# EasyEDA Pro project ProProject_Access Control USB Hub Switch_2024-05-28.epro

# Schematic V2.0.1 Schematic
Create Date: 2024-05-01; Page Name: Main Page; Project Name: Access Control V2.1; Schematic Name: V2.0.1 USB Schematic; Update Date: 2024-05-22; Company: RIT SHED MAKERSPACE; Drawn: Jim Heaney; Page Size: A4; Part Number: N/A; Reviewed: Jim Heaney; Version: V2.1.0
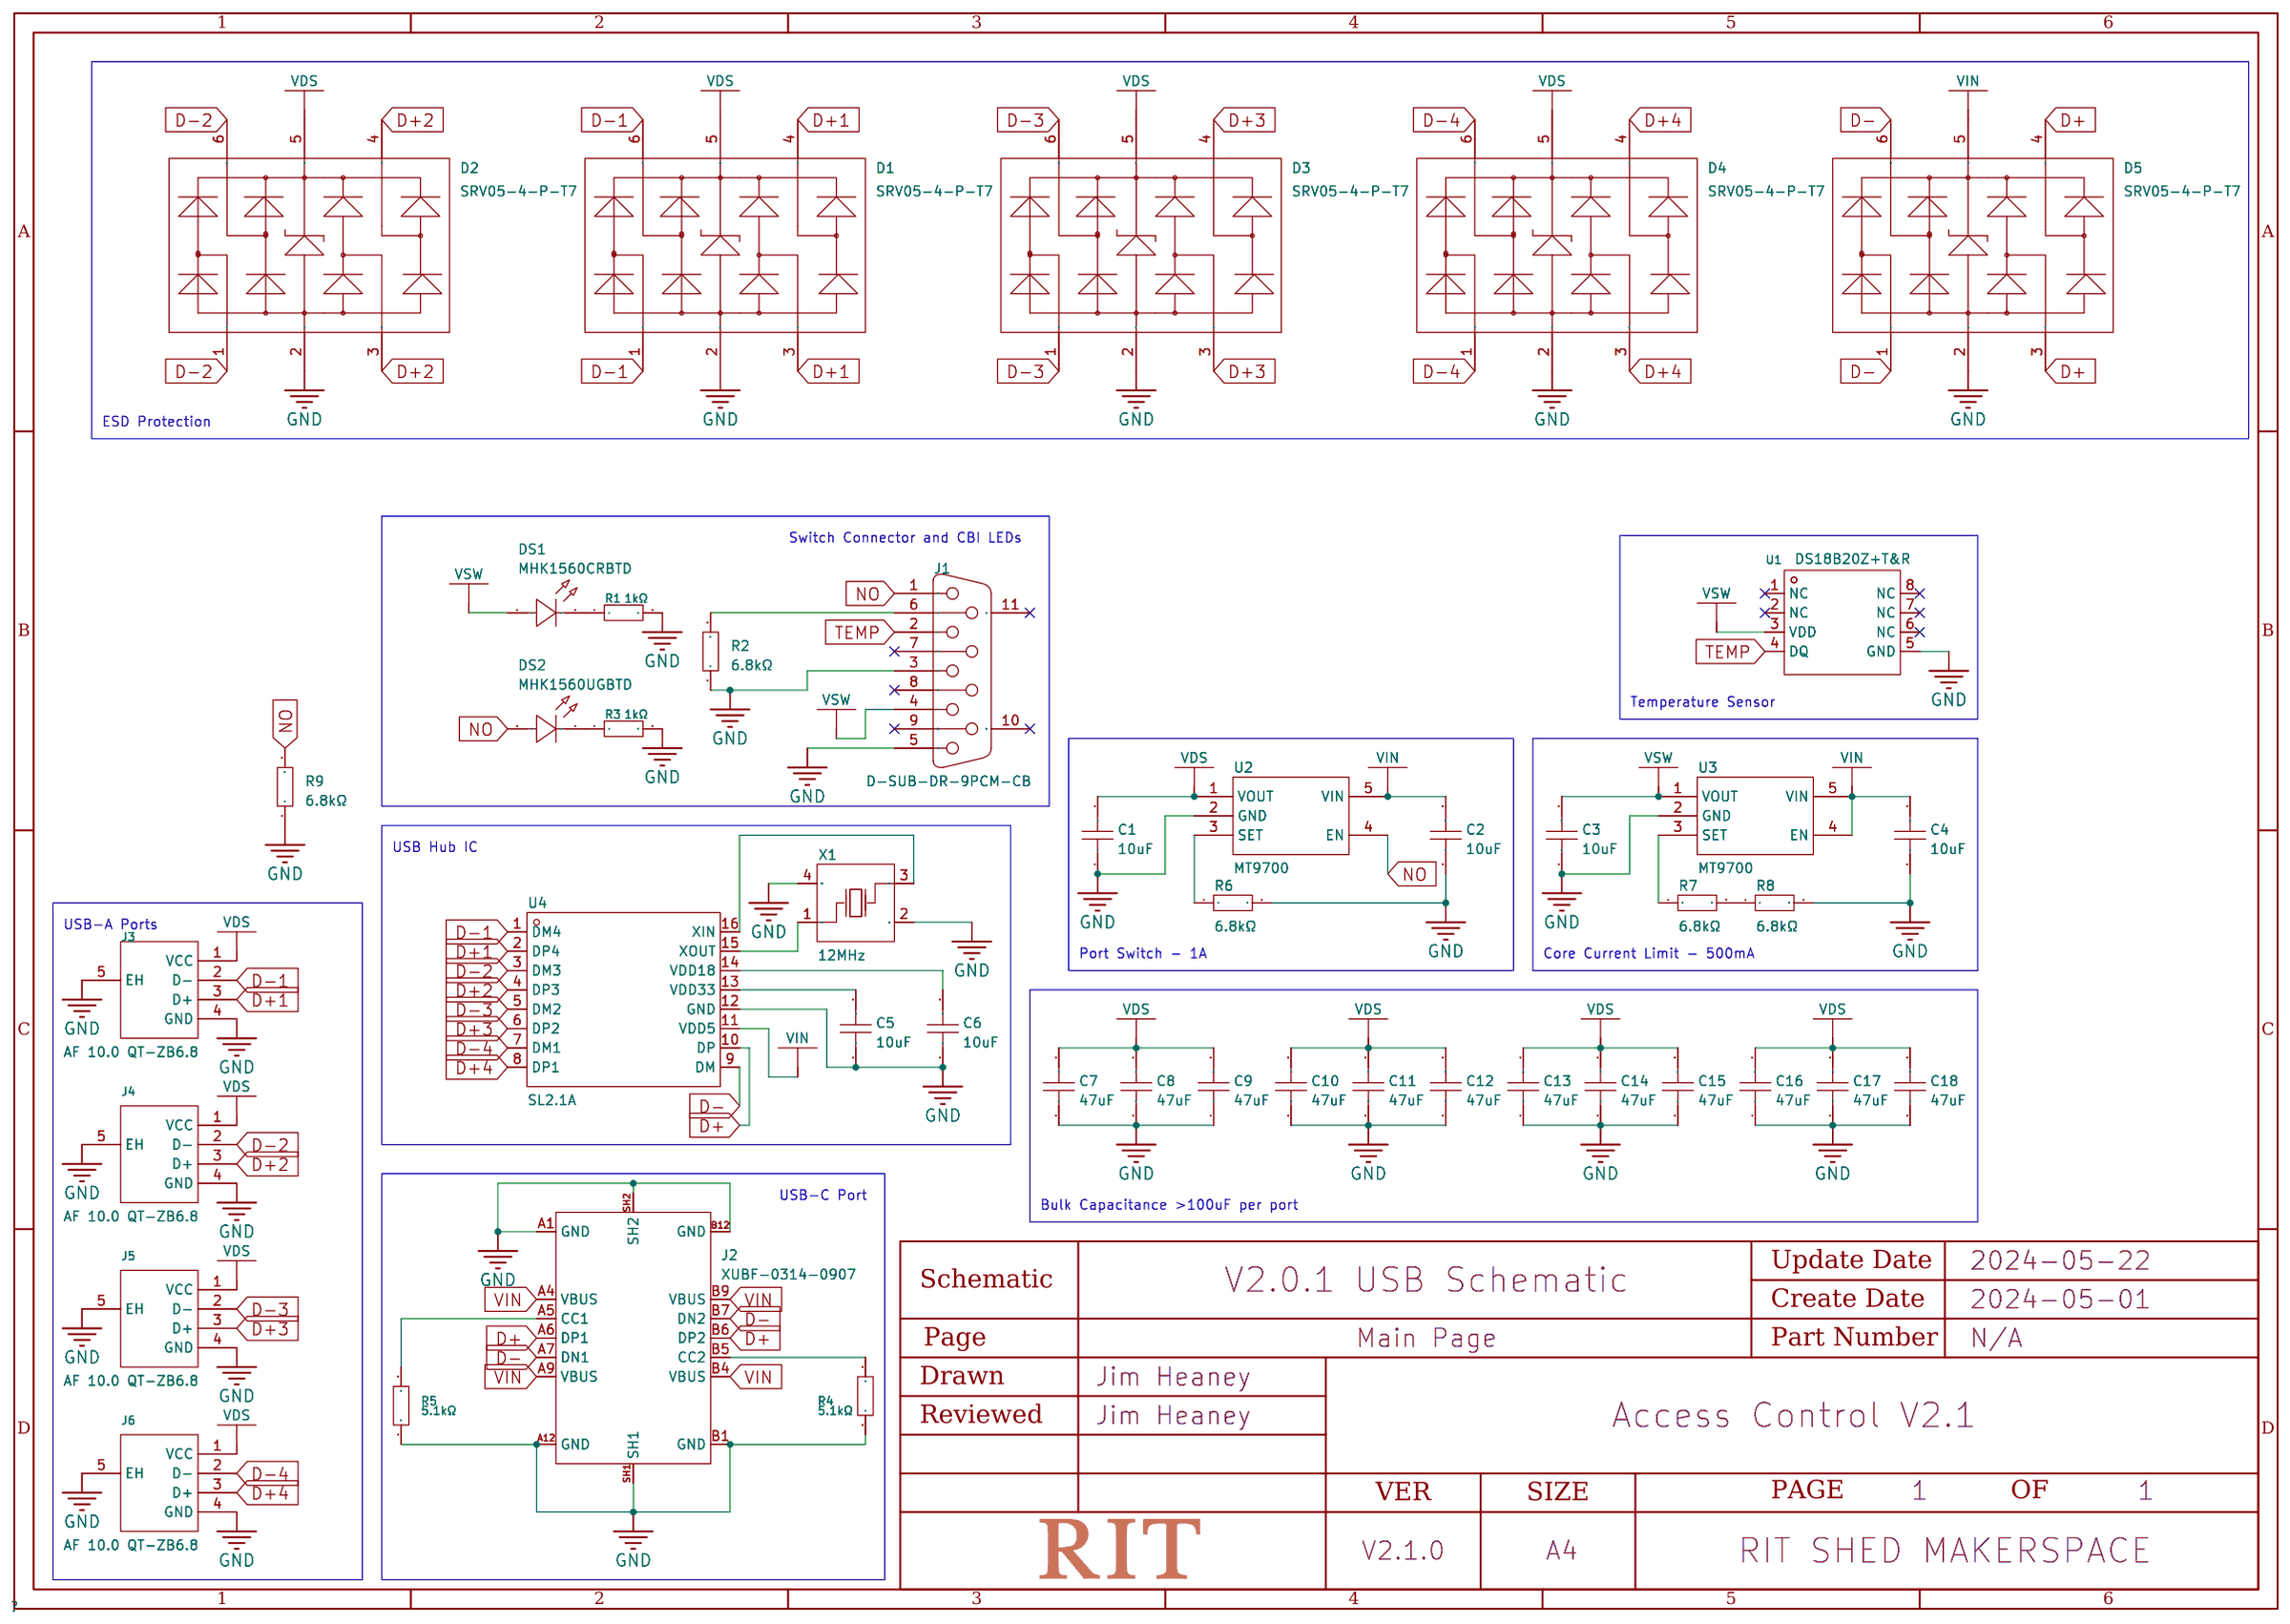
[diagram p0: schematic sheet]

## Parts
C1  10uF  [C0603]
C2  10uF  [C0603]
C3  10uF  [C0603]
C4  10uF  [C0603]
C5  10uF  [C0603]
C6  10uF  [C0603]
C7  47uF  [C1206]
C8  47uF  [C1206]
C9  47uF  [C1206]
C10  47uF  [C1206]
C11  47uF  [C1206]
C12  47uF  [C1206]
C13  47uF  [C1206]
C14  47uF  [C1206]
C15  47uF  [C1206]
C16  47uF  [C1206]
C17  47uF  [C1206]
C18  47uF  [C1206]
D1  SRV05-4-P-T7  [SOT-23-6_L2.9-W1.6-P0.95-LS2.8-BR]
D2  SRV05-4-P-T7  [SOT-23-6_L2.9-W1.6-P0.95-LS2.8-BR]
D3  SRV05-4-P-T7  [SOT-23-6_L2.9-W1.6-P0.95-LS2.8-BR]
D4  SRV05-4-P-T7  [SOT-23-6_L2.9-W1.6-P0.95-LS2.8-BR]
D5  SRV05-4-P-T7  [SOT-23-6_L2.9-W1.6-P0.95-LS2.8-BR]
DS1  MHK1560CRBTD  [LED-TH_MHK1560UGBTD]
DS2  MHK1560UGBTD  [LED-TH_MHK1560UGBTD]
J1  D-SUB-DR-9PCM-CB  [DB9-TH_ID09S33E4GV00LF]
J2  XUBF-0314-0907  [TYPE-C-TH_TYPE-C-14P-CC-2.6]
J3  AF 10.0 QT-ZB6.8  [USB-A-SMD_AF-10.0-QT-ZB6.8]
J4  AF 10.0 QT-ZB6.8  [USB-A-SMD_AF-10.0-QT-ZB6.8]
J5  AF 10.0 QT-ZB6.8  [USB-A-SMD_AF-10.0-QT-ZB6.8]
J6  AF 10.0 QT-ZB6.8  [USB-A-SMD_AF-10.0-QT-ZB6.8]
R1  1kΩ  [R0603]
R2  6.8kΩ  [R0603]
R3  1kΩ  [R0603]
R4  5.1kΩ  [R0603]
R5  5.1kΩ  [R0603]
R6  6.8kΩ  [R0603]
R7  6.8kΩ  [R0603]
R8  6.8kΩ  [R0603]
R9  6.8kΩ  [R0603]
U1  DS18B20Z+T&R  [SOIC-8_L4.9-W3.9-P1.27-LS6.0-BL]
U2  MT9700  [SOT-23-5_L3.0-W1.7-P0.95-LS2.8-BR]
U3  MT9700  [SOT-23-5_L3.0-W1.7-P0.95-LS2.8-BR]
U4  SL2.1A  [SOP-16_L10.0-W3.9-P1.27-LS6.0-BL]
X1  12MHz  [OSC-SMD_4P-L3.2-W2.5-BL]

## Library data of the parts
C1-C6 = CL10A106MA8NRNC: Capacitance: Tolerance:±20% Tolerance:±20% Voltage Rated: Temperature Coefficient:; LCSC Part Name: 10uF ±20% 25V; Supplier Part: C96446; Manufacturer: SAMSUNG(三星); Supplier Footprint: 0603; Datasheet: https://atta.szlcsc.com/upload/public/pdf/source/20170325/1490427913016.pdf; Supplier: LCSC; Tolerance: ±20%
C7-C18 = CL31A476MPHNNNE: Capacitance: Tolerance:±20% Tolerance:±20% Voltage Rated: Temperature Coefficient:; LCSC Part Name: 47uF ±20% 10V; Supplier Part: C96123; Manufacturer: SAMSUNG(三星); Supplier Footprint: 1206; Datasheet: https://atta.szlcsc.com/upload/public/pdf/source/20170228/1488267692219.pdf; Supplier: LCSC; Tolerance: ±20%
D1-D5 = SRV05-4-P-T7_C85364: Reverse Stand-Off Voltage (Vrwm):5V Breakdown Voltage:6V Peak Pulse Current (Ipp)@10/1000s:1A@8/20us Maximum Clamping Voltage:12V; LCSC Part Name: Vrwm:5V; Supplier Part: C85364; Manufacturer: PROTEK; Supplier Footprint: SOT-23-6; Datasheet: https://atta.szlcsc.com/upload/public/pdf/source/20161024/1477288764689.pdf; Supplier: LCSC; Reverse Stand-Off Voltage (Vrwm): 5V; Breakdown Voltage: 6V; Peak Pulse Current (Ipp)@10/1000μs: 1A@8/20us; Maximum Clamping Voltage: 12V
DS1 = MHK1560CGBTD: 20mA 雾状红透镜 50mcd -40℃~+85℃ 632nm Red 85° 1.75V~2.2V Plugin,P=2.54mm Light Emitting Diodes (LED) ROHS; LCSC Part Name: 1560直插单灯翠绿色光; Supplier Part: C7470835; Manufacturer: MEIHUA(美华); Supplier Footprint: 插件,P=2.54mm; JLCPCB Part Class: Extended Part; Datasheet: https://atta.szlcsc.com/upload/public/pdf/source/20231114/0151DB1F997DCF286213A722D08B4BAA.pdf; Supplier: LCSC; Emitted Color: Emerald; Forward Voltage (VF): 1.75V~2.2V; Forward Current: 20mA; Dominant Wavelength: 520nm; Lens Color: 雾状绿透镜; Luminous Intensity: 1000mcd; Viewing Angle: 85°; Operating Temperature: -40℃~+85℃
DS2 = MHK1560UGBTD: Emitted Color:Emerald Forward Voltage (VF):1.75V~2.2V Forward Voltage (VF):1.75V~2.2V Forward Current:20mA Dominant Wavelength:520nm Dominant Wavelength:520nm Lens Color:雾状绿透镜 Luminous Intensity:1000mcd Luminous Intensity:1000mcd Viewing Angle:85° Operati; LCSC Part Name: 1560直插单灯翠绿色光; Supplier Part: C7470833; Manufacturer: MEIHUA(美华); Supplier Footprint: 插件,P=2.54mm; JLCPCB Part Class: Extended Part; Datasheet: https://atta.szlcsc.com/upload/public/pdf/source/20231114/0151DB1F997DCF286213A722D08B4BAA.pdf; Supplier: LCSC; Emitted Color: Emerald; Forward Voltage (VF): 1.75V~2.2V; Forward Current: 20mA; Dominant Wavelength: 520nm; Lens Color: 雾状绿透镜; Luminous Intensity: 1000mcd; Viewing Angle: 85°; Operating Temperature: -40℃~+85℃
J1 = D-SUB-DR-9PCM-CB: Connector Type:D-Sub Gender:Female Number of Pins:9P Mounting Style:Right-Angle Number of Rows:2 Current Rating (Max):3A Contact Plating:Tin Operating Temperature Range:-50℃~+105℃ Operating Temperature Range:-50℃~+105℃; LCSC Part Name: D-Sub 母 P数:9P; Supplier Part: C19077337; Manufacturer: XUNPU(讯普); Supplier Footprint: 弯插; JLCPCB Part Class: Extended Part; Datasheet: https://atta.szlcsc.com/upload/public/pdf/source/20231108/FB2E8AB0BE4F620DDF3F7F4D0B9AFB97.pdf; Supplier: LCSC; Connector Type: D-Sub; Gender: Female; Number of Pins: 9P; Mounting Style: Right-Angle; Number of Rows: 2; Current Rating (Max): 3A; Contact Plating: Tin; Operating Temperature Range: -50℃~+105℃
J2 = TYPE-C 14P CC-2.6: DIY of C7527703; LCSC Part Name: Type-C 母 侧插; Supplier Part: C7527703; Manufacturer: Lian Xin Technology; Supplier Footprint: 插件; JLCPCB Part Class: Extended Part; Datasheet: https://wmsc.lcsc.com/wmsc/upload/file/pdf/v2/lcsc/2308251143_Lian-Xin-Technology-XUBF-0314-0907_C7527703.pdf; Supplier: LCSC; Connector Type: Type-C; Gender: Female; Number of Ports: 1; Number of Contacts: 14P; Mounting Style: Side insertion; Current Rating - Power (Max): 3A; Operating Temperature Range: -30℃~+85℃
J3-J6 = AF 10.0 QT-ZB6.8: Connector Type:Type-A Standard:USB 2.0 Gender:Female Number of Ports:1 Number of Contacts:4P Mounting Style:卧贴 Current Rating - Power (Max):1.5A Contact Material:- Contact Plating:- Operating Temperature Range:-25℃~+85℃ Operating Temperature Range:-25℃~+8; LCSC Part Name: Type-A 母 卧贴; Supplier Part: C456016; Manufacturer: SHOU HAN(首韩); Supplier Footprint: SMD; JLCPCB Part Class: Extended Part; Datasheet: https://atta.szlcsc.com/upload/public/pdf/source/20191113/C456016_27DB65DC4CC11F97930B12BCD781E5A3.pdf; Supplier: LCSC; Connector Type: Type-A; Standard: USB 2.0; Gender: Female; Number of Ports: 1; Number of Contacts: 4P; Mounting Style: 卧贴; Current Rating - Power (Max): 1.5A; Operating Temperature Range: -25℃~+85℃
R1 R3 = 0603WAF1001T5E: Type:Thick Film Resistors Resistance:1kΩ Tolerance:±1% Tolerance:±1% Power(Watts): Overload Voltage (Max): Temperature Coefficient:±100ppm/℃ Temperature Coefficient:±100ppm/℃ Operating Temperature Range:-55℃~+155℃ Operating Temperature Range:-55℃~+155℃; LCSC Part Name: 1kΩ ±1% 100mW 厚膜电阻; Supplier Part: C21190; Manufacturer: UNI-ROYAL(厚声); Supplier Footprint: 0603; JLCPCB Part Class: Basic Part; Datasheet: https://atta.szlcsc.com/upload/public/pdf/source/20200306/C422600_1E6D84923E4A46A82E41ADD87F860B5C.pdf; Supplier: LCSC; Type: Thick Film Resistors; Tolerance: ±1%; Temperature Coefficient: ±100ppm/℃; Operating Temperature Range: -55℃~+155℃
R2 R6-R9 = 0603WAF6801T5E: Type:Thick Film Resistors Resistance: Tolerance:±1% Tolerance:±1% Power(Watts): Temperature Coefficient:±100ppm/℃ Temperature Coefficient:±100ppm/℃ Overload Voltage (Max): Operating Temperature Range:-55℃~+155℃ Operating Temperature Range:-55℃~+155℃; LCSC Part Name: 6.8kΩ ±1% 100mW; Supplier Part: C23212; Manufacturer: UNI-ROYAL(厚声); Supplier Footprint: 0603; Datasheet: https://atta.szlcsc.com/upload/public/pdf/source/20200306/C422600_1E6D84923E4A46A82E41ADD87F860B5C.pdf; Supplier: LCSC; Type: Thick Film Resistors; Tolerance: ±1%; Temperature Coefficient: ±100ppm/℃; Operating Temperature Range: -55℃~+155℃
R4 R5 = 0603WAF5101T5E: Type:Thick Film Resistors Resistance:5.1kΩ Tolerance:±1% Tolerance:±1% Power(Watts): Overload Voltage (Max): Temperature Coefficient:±100ppm/℃ Temperature Coefficient:±100ppm/℃ Operating Temperature Range:-55℃~+155℃ Operating Temperature Range:-55℃~+155℃; LCSC Part Name: 5.1kΩ ±1% 100mW 厚膜电阻; Supplier Part: C23186; Manufacturer: UNI-ROYAL(厚声); Supplier Footprint: 0603; JLCPCB Part Class: Basic Part; Datasheet: https://atta.szlcsc.com/upload/public/pdf/source/20200306/C422600_1E6D84923E4A46A82E41ADD87F860B5C.pdf; Supplier: LCSC; Type: Thick Film Resistors; Tolerance: ±1%; Temperature Coefficient: ±100ppm/℃; Operating Temperature Range: -55℃~+155℃
U1 = DS18B20Z+T&R: Supply Voltage:3V~5.5V Supply Voltage:3V~5.5V; LCSC Part Name: DS18B20Z&R; Supplier Part: C97190; Manufacturer: ADI(亚德诺)/MAXIM(美信); Supplier Footprint: SOIC-8; JLCPCB Part Class: Extended Part; Datasheet: https://atta.szlcsc.com/upload/public/pdf/source/20170713/C118507_1499918901893816791.pdf; Supplier: LCSC; Supply Voltage: 3V~5.5V
U2 U3 = MT9700: Supplier Part: C89855; Manufacturer: 西安航天民芯; Supplier Footprint: SOT-23-5; Datasheet: https://atta.szlcsc.com/upload/public/pdf/source/20170418/1492481333031.pdf; Supplier: LCSC
U4 = SL2.1A: Applications Function: Protocol:; Supplier Part: C192893; Manufacturer: CoreChips(和芯润德); Supplier Footprint: SOP-16; JLCPCB Part Class: Extended Part; Datasheet: https://atta.szlcsc.com/upload/public/pdf/source/20180522/C192893_624110D24898D57AAC785E3DF98EA862.pdf; Supplier: LCSC
X1 = X322512MSB4SI: Crystal Type:SMD Crystal Resonator Frequency: Frequency Tolerance:±10ppm Frequency Tolerance:±10ppm Frequency Stability:±30ppm Frequency Stability:±30ppm Load Capacitance: Operating Temperature: Operating Temperature:; LCSC Part Name: 12MHz ±10ppm 20pF; Supplier Part: C9002; Manufacturer: YXC(扬兴晶振); Supplier Footprint: SMD3225-4P; JLCPCB Part Class: Basic Part; Datasheet: https://atta.szlcsc.com/upload/public/pdf/source/20210329/C112971_1F611BDC486E193C1706F6D8EB5AA189.pdf; Supplier: LCSC; Crystal Type: SMD Crystal Resonator; Frequency Tolerance: ±10ppm; Frequency Stability: ±30ppm

## Nets
GND: C1.1 C2.1 C3.1 C4.1 C5.1 C6.1 C7.1 C8.1 C9.1 C10.1 C11.1 C12.1 C13.1 C14.1 C15.1 C16.1 C17.1 C18.1 D1.2 D2.2 D3.2 D4.2 D5.2 J1.3 J1.5 J2.A1(GND) J2.A12(GND) J2.B1(GND) J2.B12(GND) J2.SH1 J2.SH2 J3.4(GND) J3.5(EH) J4.4(GND) J4.5(EH) J5.4(GND) J5.5(EH) J6.4(GND) J6.5(EH) R1.2 R2.1 R3.2 R4.1 R5.1 R6.2 R8.2 R9.1 U1.5(GND) U2.2(GND) U3.2(GND) U4.12(GND) X1.2(GND) X1.4(GND)
VIN: C2.2 C4.2 D5.5 J2.A4(VBUS) J2.A9(VBUS) J2.B4(VBUS) J2.B9(VBUS) U2.5(VIN) U3.4(EN) U3.5(VIN) U4.11(VDD5)
D+: D5.3 D5.4 J2.A6(DP1) J2.B6(DP2) U4.10(DP)
D+1: D1.3 D1.4 J3.3(D+) U4.2(DP4)
D+2: D2.3 D2.4 J4.3(D+) U4.4(DP3)
D+3: D3.3 D3.4 J5.3(D+) U4.6(DP2)
D+4: D4.3 D4.4 J6.3(D+) U4.8(DP1)
D-: D5.1 D5.6 J2.A7(DN1) J2.B7(DN2) U4.9(DM)
D-1: D1.1 D1.6 J3.2(D-) U4.1(DM4)
D-2: D2.1 D2.6 J4.2(D-) U4.3(DM3)
D-3: D3.1 D3.6 J5.2(D-) U4.5(DM2)
D-4: D4.1 D4.6 J6.2(D-) U4.7(DM1)
NO: DS2.2(A) J1.1 R9.2 U2.4(EN)
TEMP: J1.2 U1.4(DQ)
VDS: C1.2 C7.2 C8.2 C9.2 C10.2 C11.2 C12.2 C13.2 C14.2 C15.2 C16.2 C17.2 C18.2 D1.5 D2.5 D3.5 D4.5 J3.1(VCC) J4.1(VCC) J5.1(VCC) J6.1(VCC) U2.1(VOUT)
VSW: C3.2 DS1.2(A) J1.4 U1.3(VDD) U3.1(VOUT)
$1N967: U4.16(XIN) X1.3(OSC2)
$1N968: U4.15(XOUT) X1.1(OSC1)
$1N970: C5.2 U4.13(VDD33)
$1N972: C6.2 U4.14(VDD18)
$1N1229: R7.1 U3.3(SET)
$1N1238: R7.2 R8.1
$1N1555: R6.1 U2.3(SET)
$1N8715: J1.6 R2.2
$1N13558: DS2.1(K) R3.1
$1N13598: DS1.1(K) R1.1
Net-(J2-A5): J2.A5(CC1) R5.2
Net-(J2-B5): J2.B5(CC2) R4.2

Not connected (* = marked no-connect by the designer): J1 7* 8* 9* 10(MH1)* 11(MH2)*; U1 1(NC)* 2(NC)* 6(NC)* 7(NC)* 8(NC)*

## Notes on the sheet
- ESD Protection
- Switch Connector and CBI LEDs
- Temperature Sensor
- USB Hub IC
- USB-A Ports
- Port Switch - 1A
- Core Current Limit - 500mA
- USB-C Port
- Bulk Capacitance >100uF per port

# Board V2.0.1 PCB
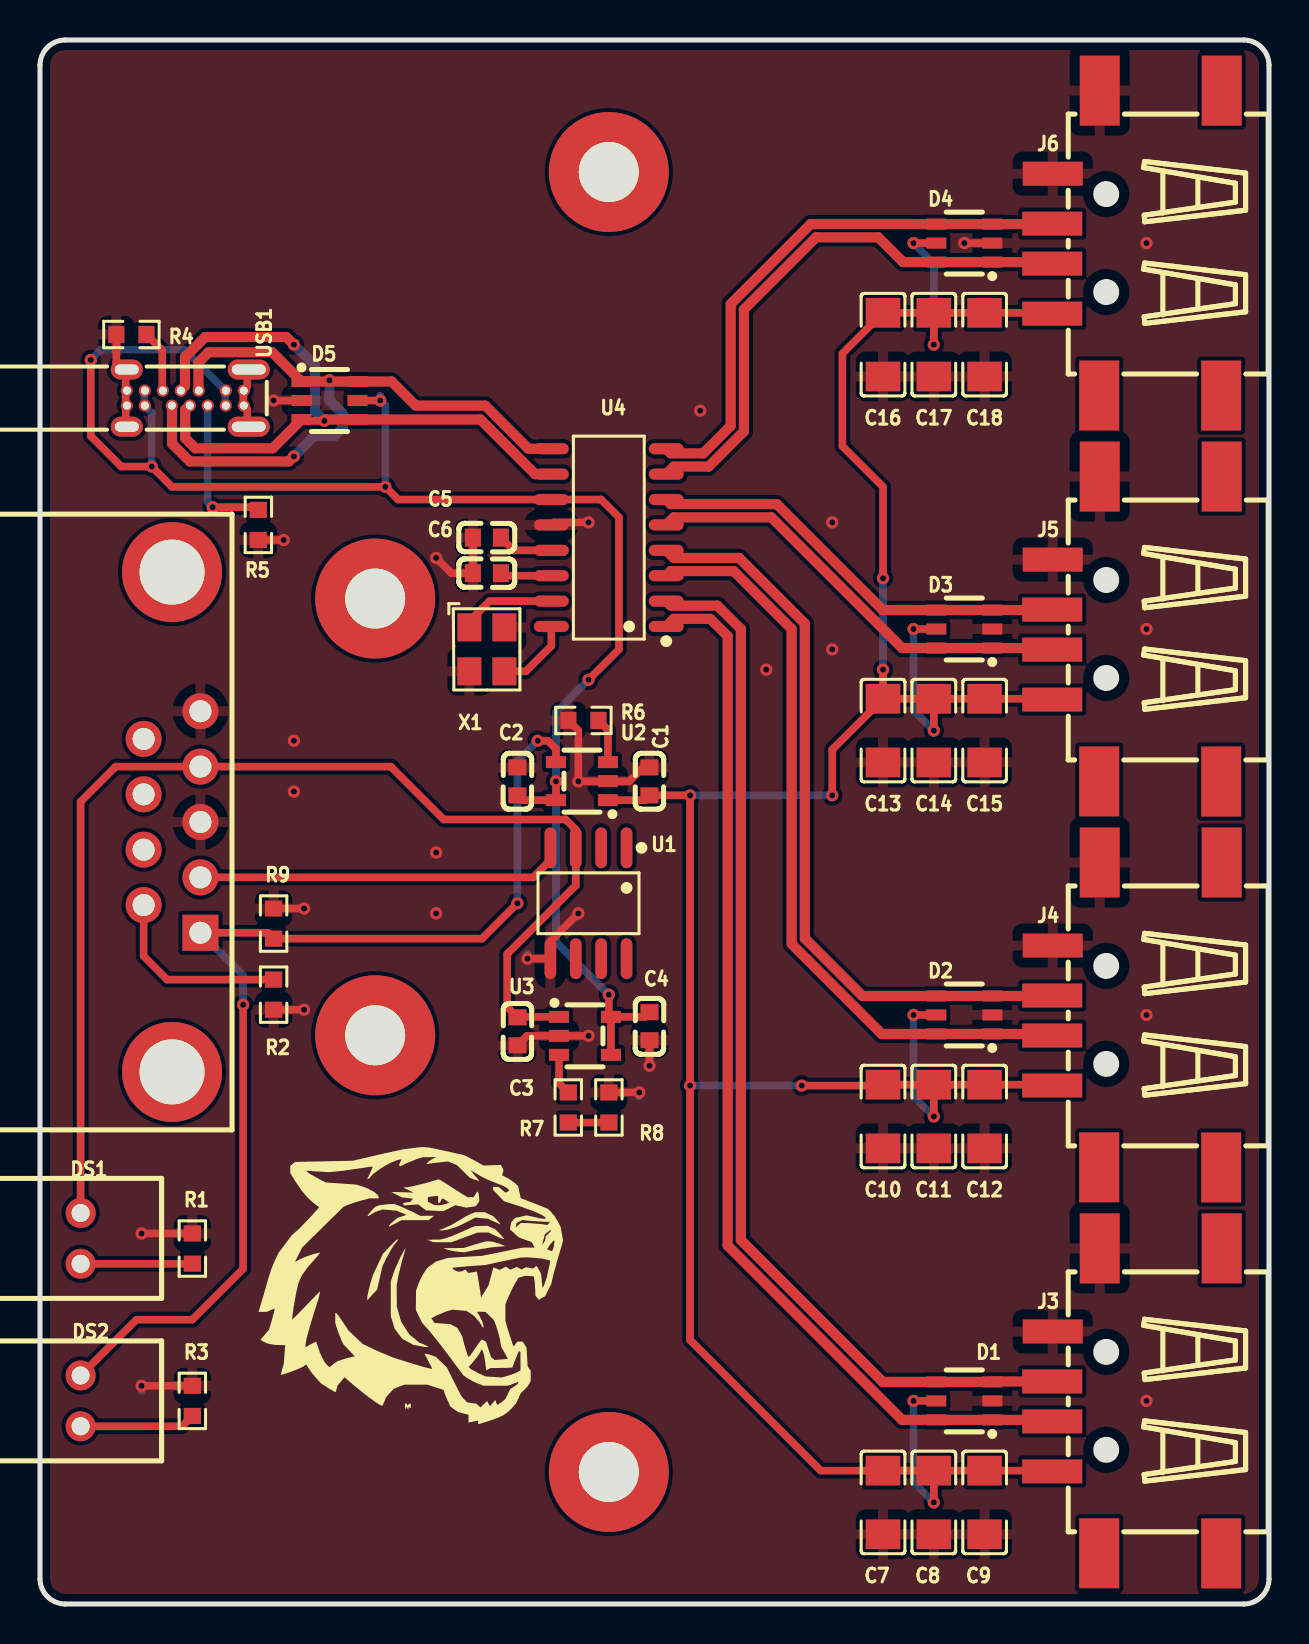
[diagram p1: board, top side]
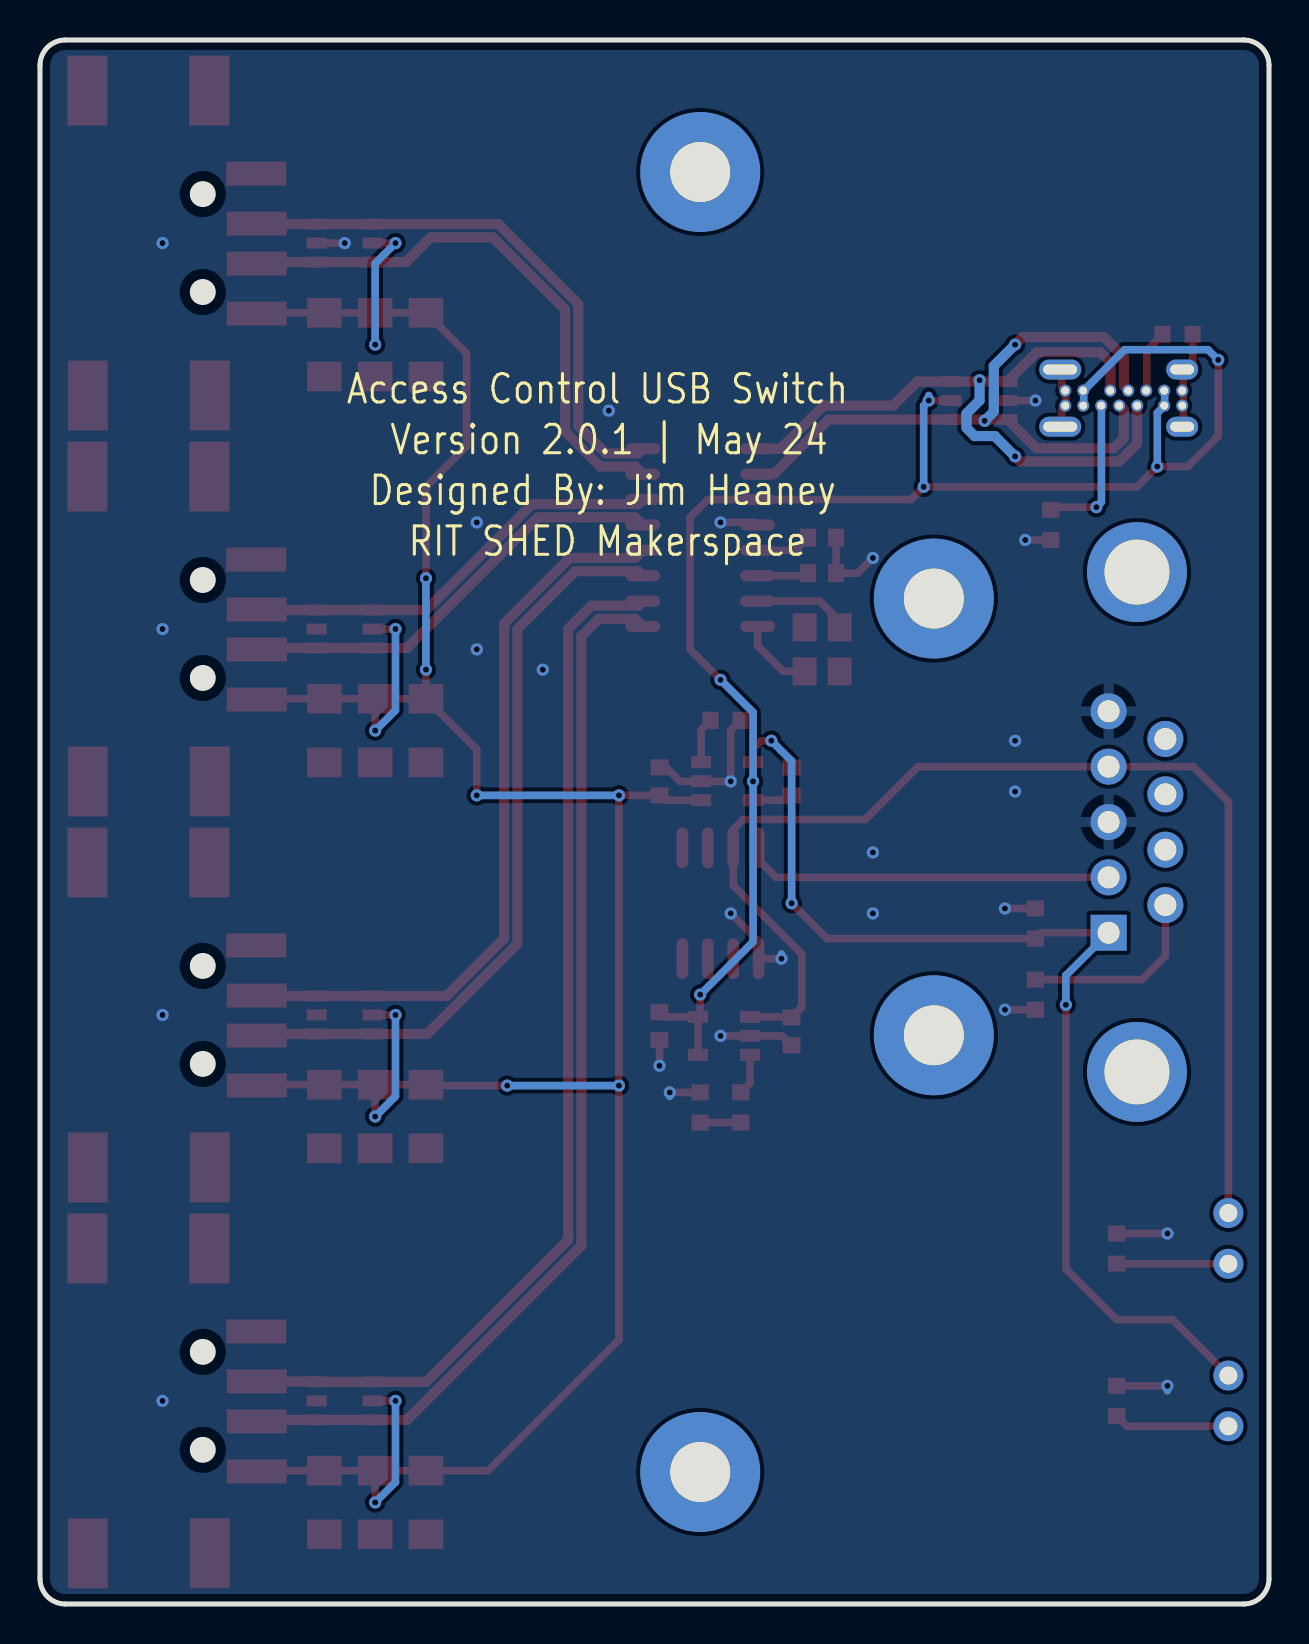
[diagram p2: board, bottom side, seen from below]

Outline 61.47 x 78.23 mm; copper layers: Top Layer, Bottom Layer. Coordinates in mm from the lower left corner of the outline.
Outline path: 0,76.96 0,1.27 arc(0.37,0.37) 1.27,0 60.2,0 arc(61.1,0.37) 61.47,1.27 61.47,76.96 arc(61.1,77.86) 60.2,78.23 1.27,78.23 arc(0.37,77.86) 0,76.96
Stack: Top Layer 0.035mm / Dielectric1 1.51mm FR4 er 4.5 / Bottom Layer 0.035mm

## Design rules (mm)
net D-1: D1
net D+1: D1
net D-2: D2
net D+2: D2
net D-3: D3
net D+3: D3
net D-4: D4
net D+4: D4
net D+: D0
net D-: D0
template: JLCPCB Capability(Two Layers Board)
spacing copperThickness1oz (default): track to track 0.102, other pairs 0.152 to 0.3
spacing copperThickness2oz: track to track 0.203, other pairs 0.152 to 0.3
track width copperThickness1oz (default): min 0.127, default 0.254, max 2.54
track width copperThickness2oz: min 0.203, default 0.254, max 2.54
differential pair differentialPair (default): width min 0.127, default 0.254, max 2.54; gap min 0.152, default 0.152
via viaSize (default): diameter min 0.5, default 0.61, max 10; hole min 0.3, default 0.305, max 6.3

## Placement (name value [footprint] x y rotation side)
C1  10uF  [C0603]  30.48 41.15 270 top
C2  10uF  [C0603]  23.88 41.15 270 top
C3  10uF  [C0603]  23.88 28.65 90 top
C4  10uF  [C0603]  30.49 28.9 90 top
C5  10uF  [C0603]  22.35 53.34 0 top
C6  10uF  [C0603]  22.35 51.56 0 top
C7  47uF  [C1206]  42.16 5.08 90 top
C8  47uF  [C1206]  44.7 5.08 90 top
C9  47uF  [C1206]  47.24 5.08 90 top
C10  47uF  [C1206]  42.16 24.38 90 top
C11  47uF  [C1206]  44.7 24.38 90 top
C12  47uF  [C1206]  47.24 24.38 90 top
C13  47uF  [C1206]  42.16 43.69 90 top
C14  47uF  [C1206]  44.7 43.69 90 top
C15  47uF  [C1206]  47.24 43.69 90 top
C16  47uF  [C1206]  42.16 62.99 90 top
C17  47uF  [C1206]  44.7 62.99 90 top
C18  47uF  [C1206]  47.24 62.99 90 top
D1  SRV05-4-P-T7  [SOT-23-6_L2.9-W1.6-P0.95-LS2.8-BR]  46.23 10.16 0 top
D2  SRV05-4-P-T7  [SOT-23-6_L2.9-W1.6-P0.95-LS2.8-BR]  46.23 29.46 0 top
D3  SRV05-4-P-T7  [SOT-23-6_L2.9-W1.6-P0.95-LS2.8-BR]  46.23 48.77 0 top
D4  SRV05-4-P-T7  [SOT-23-6_L2.9-W1.6-P0.95-LS2.8-BR]  46.23 68.07 0 top
D5  SRV05-4-P-T7  [SOT-23-6_L2.9-W1.6-P0.95-LS2.8-BR]  14.48 60.2 180 top
DS1  MHK1560CRBTD  [LED-TH_MHK1560UGBTD]  2.03 18.29 270 top
DS2  MHK1560UGBTD  [LED-TH_MHK1560UGBTD]  2.03 10.16 270 top
J1  D-SUB-DR-9PCM-CB  [DB9-TH_ID09S33E4GV00LF]  6.6 39.12 270 top
J3  AF 10.0 QT-ZB6.8  [USB-A-SMD_AF-10.0-QT-ZB6.8]  54.86 10.16 90 top
J4  AF 10.0 QT-ZB6.8  [USB-A-SMD_AF-10.0-QT-ZB6.8]  54.86 29.46 90 top
J5  AF 10.0 QT-ZB6.8  [USB-A-SMD_AF-10.0-QT-ZB6.8]  54.86 48.77 90 top
J6  AF 10.0 QT-ZB6.8  [USB-A-SMD_AF-10.0-QT-ZB6.8]  54.86 68.07 90 top
NOREF  -  [Pad_e414]  16.76 28.45 0 top
NOREF#2  -  [Pad_e413]  28.45 6.6 0 top
NOREF#3  -  [Pad_e915]  28.45 71.63 0 top
NOREF#4  -  [Pad_e415]  16.76 50.29 0 top
R1  1kΩ  [R0603]  7.62 17.78 90 top
R2  6.8kΩ  [R0603]  11.68 30.48 90 top
R3  1kΩ  [R0603]  7.62 10.16 90 top
R4  5.1kΩ  [R0603]  4.57 63.5 0 top
R5  5.1kΩ  [R0603]  10.92 53.97 90 top
R6  6.8kΩ  [R0603]  27.18 44.2 180 top
R7  6.8kΩ  [R0603]  26.42 24.84 270 top
R8  6.8kΩ  [R0603]  28.45 24.84 90 top
R9  6.8kΩ  [R0603]  11.68 34.04 270 top
U1  DS18B20Z+T&R  [SOIC-8_L4.9-W3.9-P1.27-LS6.0-BL]  27.43 35.05 180 top
U2  MT9700  [SOT-23-5_L3.0-W1.7-P0.95-LS2.8-BR]  27.1 41.16 0 top
U3  MT9700  [SOT-23-5_L3.0-W1.7-P0.95-LS2.8-BR]  27.26 28.42 180 top
U4  SL2.1A  [SOP-16_L10.0-W3.9-P1.27-LS6.0-BL]  28.45 53.34 90 top
USB1  XUBF-0314-0907  [USB-C-TH_MC-710S-Z13]  7.39 60.32 270 top
X1  12MHz  [OSC-SMD_4P-L3.2-W2.5-BL]  22.35 47.75 270 top

## Footprints (pads in the part's own frame, mm; a bottom-side part is the same pattern mirrored in y, then rotated)
C0603
  rect 0.8x0.9 smd: 1(-0.7,0) 2(0.7,0)
C1206
  rect 1.485x1.728 smd: 1(-1.593,0) 2(1.593,0)
DB9-TH_ID09S33E4GV00LF
  rect 1.8x1.8 hole 1.1: 1(5.54,1.42)
  round 1.8 hole 1.1: 2(2.77,1.42) 3(0,1.42) 4(-2.77,1.42) 5(-5.54,1.42) 6(4.155,-1.42) 7(1.385,-1.42) 8(-1.385,-1.42) 9(-4.155,-1.42)
  round 5 hole 3.25: 10(-12.5,0) 11(12.5,0)
LED-TH_MHK1560UGBTD
  round 1.5 hole 0.9: 1(1.27,0) 2(-1.27,0)
OSC-SMD_4P-L3.2-W2.5-BL
  rect 1.4x1.2 smd: 1(-1.1,-0.875) 2(1.1,-0.875) 3(1.1,0.875) 4(-1.1,0.875)
Pad_e413
  round 6 hole 3: 17(0,0)
Pad_e414
  round 6 hole 3: 17(0,0)
Pad_e415
  round 6 hole 3: 17(0,0)
Pad_e915
  round 6 hole 3: 17(0,0)
R0603
  rect 0.806x0.864 smd: 1(-0.753,0) 2(0.753,0)
SOIC-8_L4.9-W3.9-P1.27-LS6.0-BL
  oval 0.588x2.045 smd: 1(-1.905,-2.772) 2(-0.635,-2.772) 3(0.635,-2.772) 4(1.905,-2.772) 5(1.905,2.772) 6(0.635,2.772) 7(-0.635,2.772) 8(-1.905,2.772)
SOP-16_L10.0-W3.9-P1.27-LS6.0-BL
  oval 0.56x1.745 smd: 1(-4.445,-2.873) 2(-3.175,-2.873) 3(-1.905,-2.873) 4(-0.635,-2.873) 5(0.635,-2.873) 6(1.905,-2.873) 7(3.175,-2.873) 8(4.445,-2.873) 9(4.445,2.873) 10(3.175,2.873) 11(1.905,2.873) 12(0.635,2.873) 13(-0.635,2.873) 14(-1.905,2.873) 15(-3.175,2.873) 16(-4.445,2.873)
SOT-23-5_L3.0-W1.7-P0.95-LS2.8-BR
  rect 1x0.6 smd: 1(1.3,-0.95) 2(1.3,0) 3(1.3,0.95) 4(-1.3,0.95) 5(-1.3,-0.95)
SOT-23-6_L2.9-W1.6-P0.95-LS2.8-BR
  rect 1x0.55 smd: 1(1.4,-0.95) 2(1.4,0) 3(1.4,0.95) 4(-1.4,0.95) 5(-1.4,0) 6(-1.4,-0.95)
USB-A-SMD_AF-10.0-QT-ZB6.8
  rect 1.2x3 smd: 1(-3.528,4.237) 2(-1.028,4.237) 3(0.972,4.237) 4(3.472,4.213)
  rect 3.5x2 smd: 5(-7.628,-4.213) 5(-7.622,1.887) 5(7.628,1.863) 5(7.628,-4.237)
USB-C-TH_MC-710S-Z13
  oval 1x2.1 hole 0.5x1.7: 15(-1.43,3.05) 16(1.43,3.05)
  oval 1x1.6 hole 0.5x1.2: 17(-1.43,-3.05) 18(1.43,-3.05)
  round 0.6 hole 0.4: A1(0.375,2.8) A4(0.375,1.9) A5(0.375,1) A6(0.375,0.1) A7(0.375,-0.8) A9(0.375,-2.15) A12(0.375,-3.05) B1(-0.375,-3.05) B4(-0.375,-2.15) B5(-0.375,-1.25) B6(-0.375,-0.35) B7(-0.375,0.55) B9(-0.375,1.9) B12(-0.375,2.8)

## Nets
As in the schematic.

Pads without a net: J1 7 8 9 10 11; NOREF 17; NOREF#2 17; NOREF#3 17; NOREF#4 17; U1 1 2 6 7 8; USB1 15 16 17 18 A1 A4 A5 A6 A7 A9 A12 B1 B4 B5 B6 B7 B9 B12

## Via types
v1: diameter 0.61, hole 0.305, Top Layer to Bottom Layer, 56 vias

## Routing (per net, layer and track width the routed paths; a pad name or vN(x,y) marks a point on that pad's centre or on a via; arc(x,y) is an arc through that point)
GND: length 44.3
  Top Layer w0.381: C3.1 24.35,28.42 U3.2 v1(27.43,28.42) ; R8.2 v1(29.97,25.59) ; 28.42,41.15 v1(26.92,41.15) 26.92,43.7 R6.2 ; 28.42,41.15 U2.2 ; 28.42,41.15 29.46,41.15 30.16,41.85 C1.1 ; 4.22,61.71 3.82,62.11 R4.1 ; v1(19.81,52.32) 20.57,51.56 C6.1 C5.1 ; v1(26.92,34.54) 25.53,33.15 U1.5 v1(24.38,32.28) ; R9.1 v1(13.21,34.79) ; R1.2 v1(5.08,18.53) ; R5.1 v1(12.19,53.22) ; U4.12 25.7,54.1 v1(27.43,54.1) ; R3.2 v1(5.08,10.91) ; C4.1 v1(30.49,26.92) ; 4.29,61.75 4.29,58.89 ; 10.37,61.75 10.37,60.89 10.17,60.69 10.17,59.94 10.37,59.74 10.37,58.89 ; R2.1 v1(13.21,29.73) ; D4.2 v1(46.23,68.07) ; D5.2 v1(11.68,60.2)
  Bottom Layer w0.381: v1(24.38,32.28) 24.38,32.51 ; v1(12.19,53.22) 12.19,53.34 ; v1(5.08,10.91) 5.08,10.67 ; v1(29.97,25.59) 29.97,25.4
  vias: v1(12.7,43.18) v1(12.7,40.64) v1(19.81,37.59) v1(19.81,34.54) v1(33.02,59.69) v1(36.32,46.74) v1(39.62,54.1) v1(39.62,47.75) v1(55.34,68.07) v1(55.34,48.77) v1(55.34,29.46) v1(55.34,10.16)
VIN: length 84.5
  Top Layer w0.381: v1(27.43,46.23) 28.96,47.75 28.96,54.36 28.07,55.24 U4.11 17.91,55.24 v1(17.27,55.88) 6.6,55.88 v1(5.59,56.9) 4.06,56.9 2.54,58.42 v1(2.54,62.23) ; C2.2 24.11,40.21 U2.5 v1(25.8,41.15) ; 28.56,27.47 28.56,29.37 ; 28.56,29.37 28.45,29.48 v1(28.45,30.48) ; 28.56,29.37 30.25,29.37 C4.2 ; D5.5 v1(17.02,60.2)
  Bottom Layer w0.381: 9.27,59.94 9.27,60.69 7.22,62.74 3.05,62.74 v1(2.54,62.23) ; v1(27.43,46.23) 25.8,44.6 v1(25.8,41.15) 25.8,33.12 v1(28.45,30.48) ; 5.22,60.69 5.22,59.94 5.59,59.57 v1(5.59,56.9) ; 17.02,60.45 v1(17.02,60.2) 17.27,59.94 v1(17.27,55.88)
D+: length 34.2
  Top Layer w0.381: v1(14.22,59.18) 13.14,59.18 D5.3
  Top Layer w0.508: 7.47,59.94 7.26,59.74 7.26,58.31 7.77,57.81 11.64,57.81 D5.3 ; U4.10 24.76,56.51 22.03,59.25 D5.4 14.29,59.25 v1(14.22,59.18) ; 7.02,60.69 7.25,60.93 7.25,62.36 8.26,63.37 12.32,63.37 v1(12.7,62.99)
  Bottom Layer w0.508: v1(12.7,62.99) 13.77,61.93 13.77,59.64 v1(14.22,59.18)
D+1: length 53.4
  Top Layer w0.508: U4.2 31.55,49.94 33.88,49.94 35.05,48.77 35.05,18.21 42.15,11.11 D1.4 D1.3 47.65,11.13 J3.3
D+2: length 37.8
  Top Layer w0.508: U4.4 31.7,52.32 34.97,52.32 38.25,49.04 38.25,33.29 41.13,30.41 D2.4 D2.3 50.6,30.41 J4.3
D+3: length 21.6
  Top Layer w0.508: U4.6 31.55,55.02 36.85,55.02 42.15,49.72 D3.4 D3.3 50.6,49.72 J5.3
D+4: length 27.7
  Top Layer w0.508: J6.3 50.6,69.02 D4.3 D4.4 38.54,69.02 34.54,65.02 34.54,58.93 33.17,57.56 31.55,57.56 U4.8
D-: length 35.4
  Top Layer w0.508: 6.57,59.94 6.6,59.91 6.6,58.04 7.49,57.15 12.45,57.15 v1(12.7,57.4) ; U4.9 24.43,57.78 22.27,59.94 18.8,59.94 17.59,61.15 D5.6 14.54,61.15 v1(14.48,61.21) 14.41,61.15 D5.1 11.61,62.61 8.43,62.61 7.92,62.1 7.92,60.75
  Bottom Layer w0.508: v1(14.48,61.21) 14.48,60.2 15.13,59.55 15.13,58.83 14.72,58.42 13.72,58.42 v1(12.7,57.4)
D-1: length 53.9
  Top Layer w0.508: 31.32,48.89 31.7,49.28 33.53,49.28 34.39,48.41 34.39,17.93 43.11,9.21 D1.6 D1.1 50.55,9.21 J3.2
D-2: length 38.2
  Top Layer w0.508: U4.3 31.55,51.66 34.7,51.66 37.59,48.77 37.59,33.02 42.1,28.51 D2.6 D2.1 50.55,28.51 J4.2
D-3: length 22.2
  Top Layer w0.508: J5.2 50.55,47.82 D3.1 D3.6 43.11,47.82 36.58,54.36 31.7,54.36 U4.5
D-4: length 28.3
  Top Layer w0.508: U4.7 31.7,56.9 33.45,56.9 35.2,58.65 35.2,64.75 38.82,68.36 41.92,68.36 43.16,67.12 D4.6 D4.1 50.55,67.12 J6.2
NO: length 55
  Top Layer w0.381: v1(23.88,35.05) 22.11,33.28 R9.2 11.39,33.58 J1.1 ; U2.4 25.8,42.78 25.4,43.18 v1(24.89,43.18) ; DS2.2 4.83,14.22 7.62,14.22 10.16,16.76 v1(10.16,29.97)
  Bottom Layer w0.381: J1.1 10.16,31.44 v1(10.16,29.97) ; v1(24.89,43.18) 23.88,42.16 v1(23.88,35.05)
TEMP: length 18.5
  Top Layer w0.381: J1.2 24.66,36.35 25.53,37.21 U1.4
VDS: length 154.3
  Top Layer w0.381: v1(44.7,62.99) C17.2 ; C17.2 C18.2 50.59,64.58 J6.1 ; C17.2 C16.2 40.13,62.55 40.13,57.91 42.16,55.88 v1(42.16,51.31) ; J3.1 50.59,6.67 C9.2 C8.2 ; C8.2 C7.2 39.05,6.67 32.51,13.21 v1(32.51,25.93) v1(32.51,40.45) C1.2 30.24,40.21 U2.1 ; C8.2 v1(44.7,5.08) ; C13.2 v1(42.16,46.74) ; C13.2 39.62,42.74 v1(39.62,40.45) ; C13.2 C14.2 ; v1(44.7,24.38) C11.2 ; C11.2 C12.2 50.59,25.98 J4.1 ; C11.2 C10.2 42.12,25.93 v1(38.1,25.93) ; D3.5 v1(43.69,48.77) ; J5.1 50.59,45.28 C15.2 C14.2 ; D1.5 v1(43.69,10.16) ; D4.5 v1(43.69,68.07) ; v1(44.7,43.69) C14.2 ; D2.5 v1(43.69,29.46)
  Bottom Layer w0.381: v1(32.51,40.45) v1(39.62,40.45) ; v1(42.16,46.74) v1(42.16,51.31) ; v1(43.69,29.46) 43.69,25.4 v1(44.7,24.38) ; v1(43.69,48.77) 43.69,44.7 v1(44.7,43.69) ; v1(43.69,10.16) 43.69,6.1 v1(44.7,5.08) ; v1(43.69,68.07) 44.7,67.06 v1(44.7,62.99) ; v1(32.51,25.93) v1(38.1,25.93)
VSW: length 60.5
  Top Layer w0.381: DS1.2 2.03,40.13 3.79,41.89 J1.4 17.55,41.89 20.19,39.24 26.29,39.24 26.8,38.73 U1.3 26.8,35.94 23.37,32.51 23.37,29.86 C3.2 23.9,29.37 U3.1
$1N967: length 3.8
  Top Layer w0.381: 25.58,48.89 25.58,47.93 24.3,46.65 X1.3
$1N968: length 4.8
  Top Layer w0.381: U4.15 22.48,50.16 21.48,49.16 X1.1
$1N970: length 2.8
  Top Layer w0.381: C5.2 23.69,52.7 U4.13
$1N972: length 2.6
  Top Layer w0.381: U4.14 23.18,51.43 C6.2
$1N1229: length 2.1
  Top Layer w0.381: R7.1 25.96,26.05 U3.3
$1N1238: length 2
  Top Layer w0.381: 26.42,24.08 28.45,24.08
$1N1555: length 2.3
  Top Layer w0.381: U2.3 28.4,43.72 R6.1
$1N8715: length 9.5
  Top Layer w0.381: J1.6 5.18,32.41 6.36,31.23 R2.2
$1N13558: length 5.8
  Top Layer w0.381: R3.1 7.1,8.89 DS2.1
$1N13598: length 5.6
  Top Layer w0.381: DS1.1 7.61,17.02 R1.1
$1N16584: length 7.5
  Top Layer w0.381: R5.2 10.79,54.86 v1(8.64,54.86)
  Bottom Layer w0.381: 8.37,59.94 8.38,59.93 8.38,55.12 v1(8.64,54.86)
$1N16606: length 3.1
  Top Layer w0.381: R4.2 6.12,62.71 6.12,60.69

## Copper pours and planes (outline as drawn; the poured copper is in the pictures)
GND on Top Layer: -2.03,85.34 64.01,85.34 64.01,-12.19 -2.03,-12.19
GND on Bottom Layer: -11.68,79.76 74.17,79.76 74.17,-1.52 -11.68,-1.52

## Text on the board
Bottom Silkscreen Layer: RIT SHED Makerspace | Version 2.0.1 | May 24 | Designed By: Jim Heaney | Access Control USB Switch
